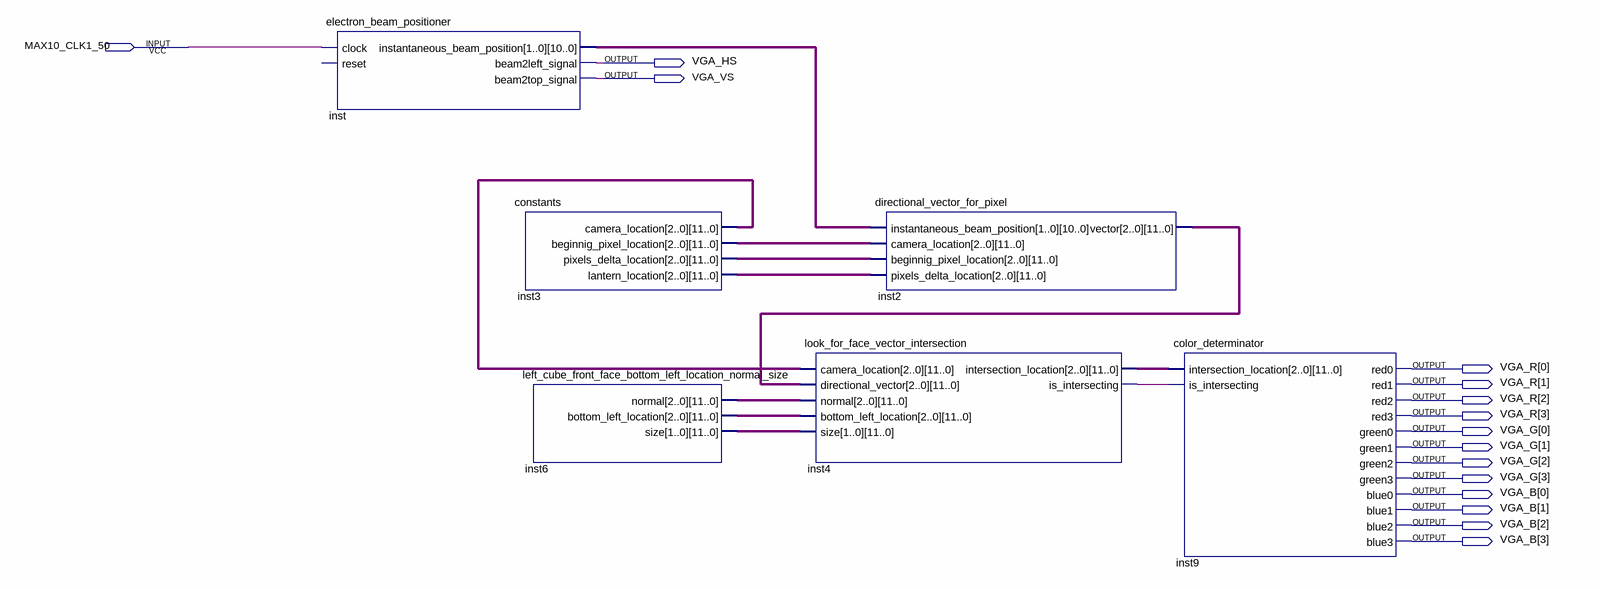
[diagram p0: schematic sheet]
// Quartus schematic fpga.bdf as structural Verilog: 6 symbols, 15 pins
module fpga (
  input  MAX10_CLK1_50,
  output VGA_HS,
  output VGA_VS,
  output [3:0] VGA_R,
  output [3:0] VGA_G,
  output [3:0] VGA_B
);

  wire inst4_is_intersecting;
  wire [21:0] inst_instantaneous_beam_position;
  wire [23:0] inst6_size;
  wire [35:0] inst2_vector, inst3_beginnig_pixel_location, inst3_camera_location, inst3_lantern_location,
       inst3_pixels_delta_location, inst4_intersection_location, inst6_bottom_left_location, inst6_normal;

  electron_beam_positioner inst (
    .clock(MAX10_CLK1_50), .instantaneous_beam_position(inst_instantaneous_beam_position),
    .beam2left_signal(VGA_HS), .beam2top_signal(VGA_VS));  // open: reset
  constants inst3 (
    .camera_location(inst3_camera_location), .beginnig_pixel_location(inst3_beginnig_pixel_location),
    .pixels_delta_location(inst3_pixels_delta_location), .lantern_location(inst3_lantern_location));
  left_cube_front_face_bottom_left_location_normal_size inst6 (
    .normal(inst6_normal), .bottom_left_location(inst6_bottom_left_location), .size(inst6_size));
  look_for_face_vector_intersection inst4 (
    .camera_location(inst3_camera_location), .directional_vector(inst2_vector), .normal(inst6_normal),
    .bottom_left_location(inst6_bottom_left_location), .size(inst6_size),
    .intersection_location(inst4_intersection_location), .is_intersecting(inst4_is_intersecting));
  directional_vector_for_pixel inst2 (
    .instantaneous_beam_position(inst_instantaneous_beam_position),
    .camera_location(inst3_beginnig_pixel_location), .beginnig_pixel_location(inst3_pixels_delta_location),
    .pixels_delta_location(inst3_lantern_location), .vector(inst2_vector));
  color_determinator inst9 (
    .intersection_location(inst4_intersection_location), .is_intersecting(inst4_is_intersecting),
    .red0(VGA_R[0]), .red1(VGA_R[1]), .red2(VGA_R[2]), .red3(VGA_R[3]), .green0(VGA_G[0]), .green1(VGA_G[1]),
    .green2(VGA_G[2]), .green3(VGA_G[3]), .blue0(VGA_B[0]), .blue1(VGA_B[1]), .blue2(VGA_B[2]),
    .blue3(VGA_B[3]));
endmodule
